# Altium schematic sheet Acionamentos valvula.SchDoc: Acionamento valvulas
size A4; Date: 22/04/2023; ApprovedBy: Douglas F.; Author: Douglas F.; DocumentNumber: GERABS01; Revision: 1.0; SheetNumber: 3; SheetTotal: 4; Application_BuildNumber: GerAbs01
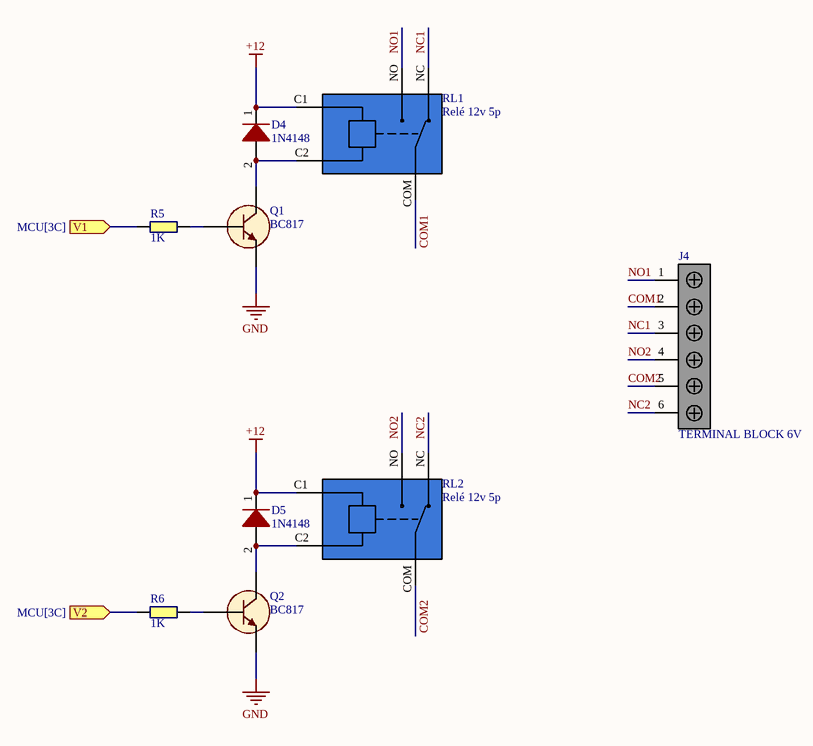
[diagram p0: Acionamentos valvula.SchDoc]

## Parts
D4  1N4148  [DIOMELF3516N]
D5  1N4148  [DIOMELF3516N]
J4  TERMINAL BLOCK 6V  [Terminal block 5mm 6V]
Q1  BC817  [SOT23]
Q2  BC817  [SOT23]
R5  1K  [RESISTOR 1/4W 0805]
R6  1K  [RESISTOR 1/4W 0805]
RL1  Relé 12v 5p  [RELAY]
RL2  Relé 12v 5p  [RELAY]

## Ports
V1 (in, see MCU[3C]), V2 (in, see MCU[3C])

## Nets
+12: D4.1 D5.1 RL1.C1(COIL_1) RL2.C1(COIL_1)
GND: Q1.2(E) Q2.2(E)
COM1: J4.2 RL1.COM
COM2: J4.5 RL2.COM
NC1: J4.3 RL1.NC
NC2: J4.6 RL2.NC
NO1: J4.1 RL1.NO
NO2: J4.4 RL2.NO
V1: R5.1 ; port V1
V2: R6.1 ; port V2
NetD4_2: D4.2 Q1.3(C) RL1.C2(COIL_2)
NetD5_2: D5.2 Q2.3(C) RL2.C2(COIL_2)
NetQ1_1: Q1.1(B) R5.2
NetQ2_1: Q2.1(B) R6.2

## Notes on the sheet
- PROJETO
- REV
- TITULO
- PÁG
- DE
- NÚMERO
- DESIGNER
- REVISADO POR
- DATA
- ARQUIVO
- TAMANHO
- A4

## Library data of the parts
D4 D5 = DIODO 1N4148: Diodo rapido; Published: 8-Jun-2000; LatestRevisionDate: 17-Jul-2002; LatestRevisionNote: Re-released for DXP Platform.; DatasheetVersion: 1997; PackageReference: DO-35; Publisher: Altium Limited; PackageDescription: Diode, Axial; Body 3.8 x 1.9 mm (LxDia. max), Lead Dia. 0.53 mm (max); Code_JEDEC: DO-204-AH; ComponentLink1Description: Manufacturer Link; ComponentLink1URL: http://www.fairchildsemi.com/; ComponentLink2Description: Datasheet; ComponentLink2URL: http://www.fairchildsemi.com/ds/1N%2F1N4148.pdf
J4 = TERMINAL BLOCK 6V: Block, Terminal; 6 A; 63 V; 5 mm; 26 to 20 AWG; 6 Screw; Soldering; 1.5 kV
R5 R6 = RESISTOR 1/4W: Resistor; Published: 8-Jun-2000; LatestRevisionDate: 17-Jul-2002; LatestRevisionNote: Re-released for DXP Platform.; PackageReference: AXIAL-0.4; Publisher: Altium Limited; PackageDescription: Axial Device, Thru-Hole; 2 Leads; 0.4 in Pin Spacing